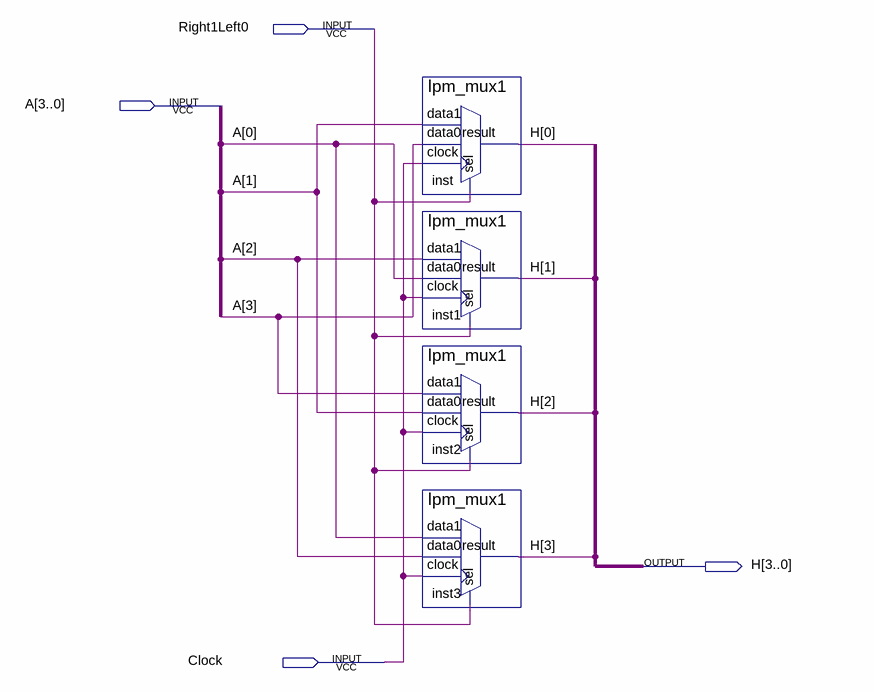
[diagram p0: schematic sheet]
// Quartus schematic ShiftFunction.bdf as structural Verilog: 4 symbols, 4 pins
module ShiftFunction (
  input  Right1Left0,
  input  [3:0] A,
  input  Clock,
  output [3:0] H
);

  lpm_mux1 inst (.data1(A[1]), .data0(A[3]), .clock(Clock), .sel(Right1Left0), .result(H[0]));
  lpm_mux1 inst1 (.data1(A[2]), .data0(A[0]), .clock(Clock), .sel(Right1Left0), .result(H[1]));
  lpm_mux1 inst2 (.data1(A[3]), .data0(A[1]), .clock(Clock), .sel(Right1Left0), .result(H[2]));
  lpm_mux1 inst3 (.data1(A[0]), .data0(A[2]), .clock(Clock), .sel(Right1Left0), .result(H[3]));
endmodule
